# Altium schematic sheet LCD-connector.SchDoc
size A4; Organization: Altium Limited; Address1: L3, 12a Rodborough Rd; Address2: Frenchs Forest; Address3: NSW; Address4: Australia 2086
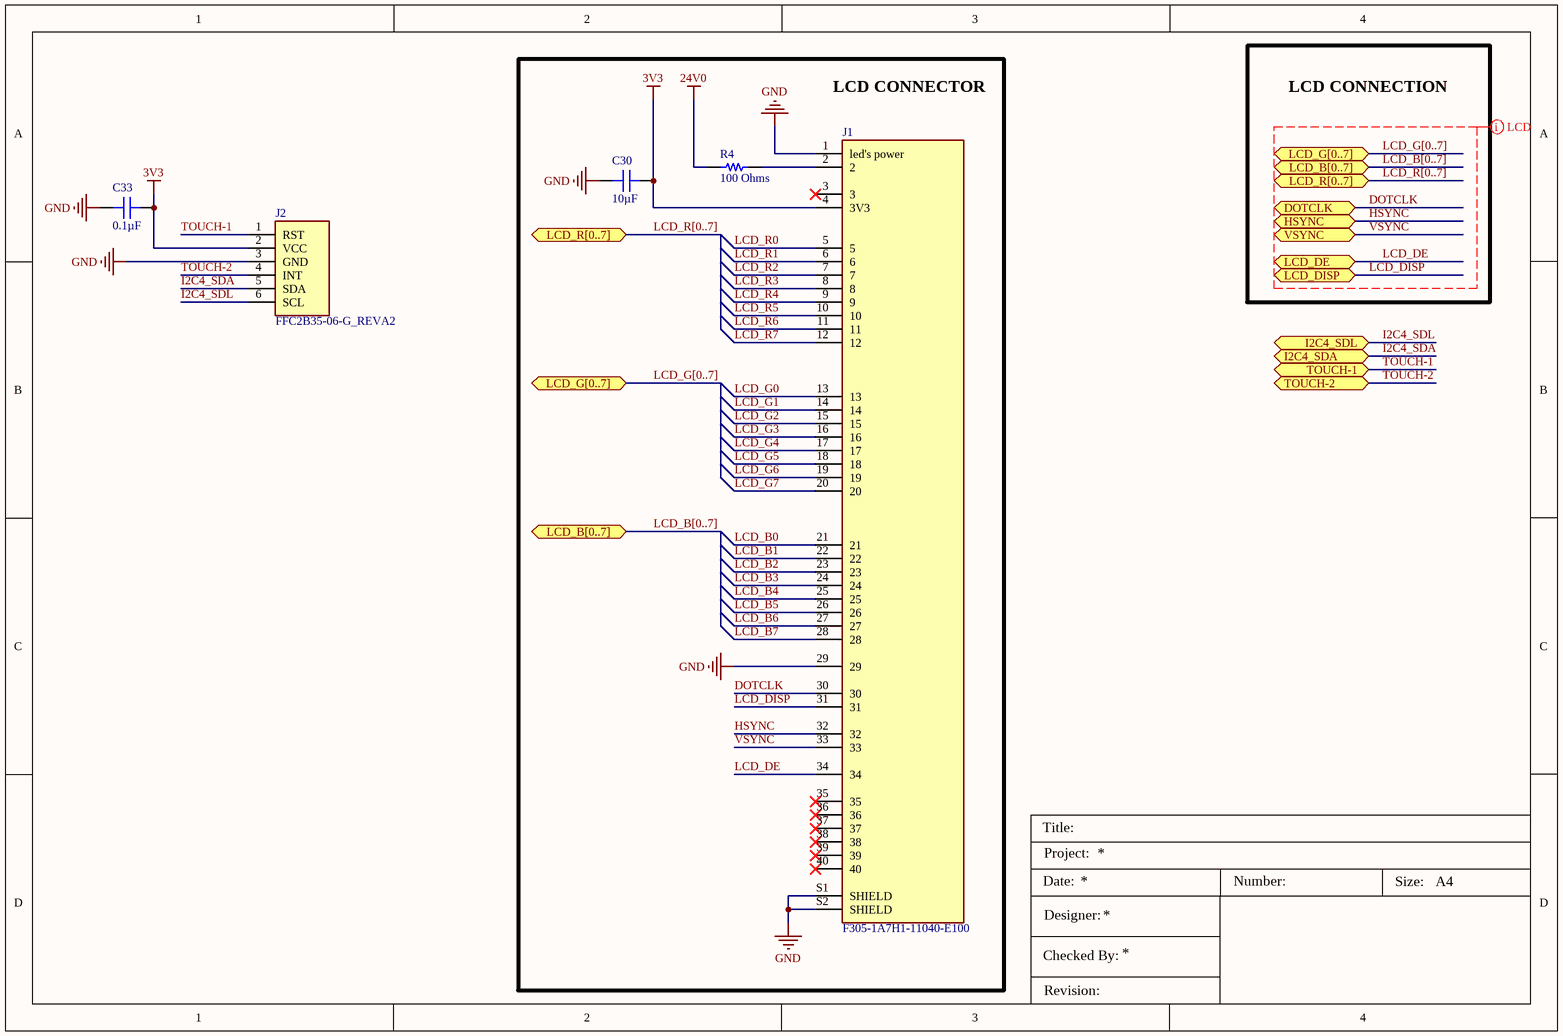
[diagram p0: LCD-connector.SchDoc]

## Parts
C30  10µF  [CAP 0805_2012]
C33  0.1µF  [CAP 0603_1608]
J1  F305-1A7H1-11040-E100  [F305-1A7H1-11040-E100]
J2  FFC2B35-06-G_REVA2  [GCT_FFC2B35-06-G_REVA2]
R4  100 Ohms  [RES 1206_3216]

## Blocks framed on the sheet
LCD CONNECTOR: C30 J1 R4

## Ports
DOTCLK (bidir), HSYNC (bidir), I2C4_SDA (bidir), I2C4_SDL (bidir), LCD_B[0..7] (bidir), LCD_DE (bidir), LCD_DISP (bidir), LCD_G[0..7] (bidir), LCD_R[0..7] (bidir), TOUCH-1 (bidir), TOUCH-2 (bidir), VSYNC (bidir)

## Nets
3V3: C30.2 C33.1 J1.4(3V3) J2.2(VCC)
24V0: R4.1
GND: C30.1 C33.2 J1.1(led's_power) J1.29 J1.S1(SHIELD) J1.S2(SHIELD) J2.3(GND)
DOTCLK: J1.30 ; port DOTCLK
HSYNC: J1.32 ; port HSYNC
I2C4_SDA: J2.5(SDA) ; port I2C4_SDA
I2C4_SDL: J2.6(SCL) ; port I2C4_SDL
LCD_B0: J1.21
LCD_B1: J1.22
LCD_B2: J1.23
LCD_B3: J1.24
LCD_B4: J1.25
LCD_B5: J1.26
LCD_B6: J1.27
LCD_B7: J1.28
LCD_DE: J1.34 ; port LCD_DE
LCD_DISP: J1.31 ; port LCD_DISP
LCD_G0: J1.13
LCD_G1: J1.14
LCD_G2: J1.15
LCD_G3: J1.16
LCD_G4: J1.17
LCD_G5: J1.18
LCD_G6: J1.19
LCD_G7: J1.20
LCD_R0: J1.5
LCD_R1: J1.6
LCD_R2: J1.7
LCD_R3: J1.8
LCD_R4: J1.9
LCD_R5: J1.10
LCD_R6: J1.11
LCD_R7: J1.12
TOUCH-1: J2.1(RST) ; port TOUCH-1
TOUCH-2: J2.4(INT) ; port TOUCH-2
VSYNC: J1.33 ; port VSYNC
NetJ1_2: J1.2 R4.2

Not connected (* = marked no-connect by the designer): J1 3* 35* 36* 37* 38* 39* 40*

## Buses and harness runs
bus LCD_B[0..7] = port LCD_B[0..7]
bus LCD_G[0..7] = port LCD_G[0..7]
bus LCD_R[0..7] = port LCD_R[0..7]

## Layout directives
net class LCD: DOTCLK, HSYNC, LCD_B[0..7], LCD_DE, LCD_DISP, LCD_G[0..7], LCD_R[0..7], VSYNC

## Notes on the sheet
- LCD CONNECTION
- Title:
- Project:
- Date:
- Designer:
- Number:
- Size:
- A4
- Checked By:
- Revision:

## Library data of the parts
C30 = CL21A106MQFNNNE: CAP CER 10UF 6.3V X5R 0805; Manufacturer: Samsung Electro-Mechanics; Tolerance: ±20%; Part Number: CL21A106MQFNNNE; Value: 10µF; Applications: General Purpose; Capacitance: 10µF; ComponentLink1Description: Datasheet; ComponentLink1URL: http://www.samsungsem.com/kr/support/product-search/mlcc/CL21A106MQFNNNE.jsp; ComponentLink2Description: DigiKey Link; ComponentLink2URL: http://digikey.com/product-detail/en/samsung-electro-mechanics/CL21A106MQFNNNE/1276-1298-1-ND/3889384; Device Package: 0805 (2012 Metric); LastUpdated: 9/2/2020 1:04:40 AM; Lifecycle Status: Active; Minimum Order: 1; Mounting Type: Surface Mount, MLCC; Operating Temperature: -55°C ~ 85°C; Package / Case: 0805 (2012 Metric); Packaging: TapeAndReel; PartId: 3169; Part Status: Active; Price: 0.02; Series: CL; Size / Dimension: 0.079" L x 0.049" W (2.00mm x 1.25mm); Supplier 1: DigiKey; Supplier Part Number 1: 1276-1298-1-ND; Temperature Coefficient: X5R; Thickness (Max): 0.053" (1.35mm); Voltage - Rated: 6.3V
C33 = 6R3X14W104MV4T: CAP CER 0.1UF 6.3V X7R 0603; Part Number: 6R3X14W104MV4T; Value: 0.1µF
J1 = LCD Connector: 40 Position FFC, FPC Connector Contacts, Bottom 0.020" (0.50mm) Surface Mount, Right Angle; MF: Amphenol ICC (FCI); MP: F305-1A7H1-11040-E100; Price: None; Availability: Unavailable; Package: None; Digikey_Link: https://www.digikey.com/en/products/detail/amphenol-icc-fci/F305-1A7H1-11040-E100/11564644; Value: *
J2 = FFC2B35-06-G_REVA2: 0.5mm Side entry Flat Flexible Cable Connector; MF: Global Connector Technology; SnapEDA_Link: https://www.snapeda.com/parts/FFC2B35-06-G/Global+Connector+Technology/view-part/?ref=snap; Price: None; Check_prices: https://www.snapeda.com/parts/FFC2B35-06-G/Global+Connector+Technology/view-part/?ref=eda; Availability: In Stock; Value: *; MP: FFC2B35-06-G; Package: None; Purchase-URL: https://pricing.snapeda.com/search/part/FFC2B35-06-G/?ref=eda
R4 = CRG1206F100R: RES SMD 100 OHM 1% 1/4W 1206; Manufacturer: TE Connectivity Passive Product; Power (Watts): 0.25W, 1/4W; Temperature Coefficient: ±200ppm/°C; Part Number: CRG1206F100R; ComponentLink1Description: Datasheet; ComponentLink1URL: https://www.te.com/commerce/DocumentDelivery/DDEController?Action=srchrtrv&DocNm=1773204&DocType=DS&DocLang=English; ComponentLink2Description: DigiKey Link; ComponentLink2URL: http://digikey.com/product-detail/en/te-connectivity-passive-product/CRG1206F100R/A106068CT-ND/3477719; Composition: Thick Film; Device Package: 1206 (3216 Metric); Height - Seated (Max): 0.026" (0.65mm); LastUpdated: 9/2/2020 1:13:10 AM; Lifecycle Status: Active; Minimum Order: 1; Number of Terminations: 2; Operating Temperature: -55°C ~ 155°C; Package / Case: 1206 (3216 Metric); Packaging: TapeAndReel; PartId: 26991; Part Status: Active; Price: 0.01; Resistance: 100 Ohms; Series: CRG, Neohm; Size / Dimension: 0.122" L x 0.061" W (3.10mm x 1.55mm); Supplier 1: DigiKey; Supplier Part Number 1: A106068CT-ND; Supplier Device Package: 1206; Tolerance: ±1%; Value: 100 Ohms